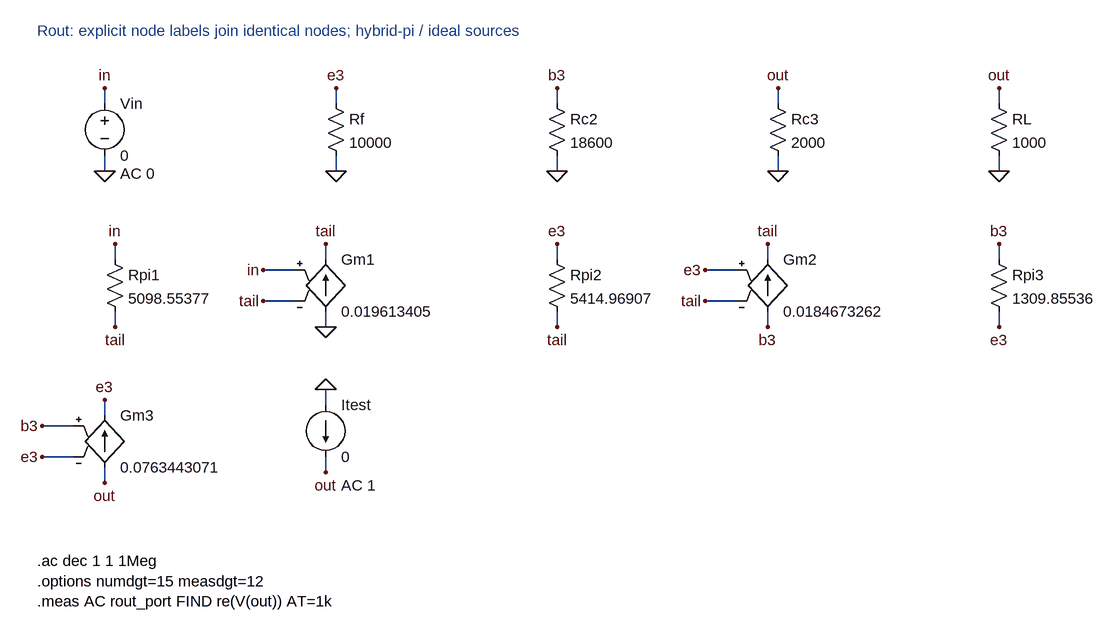
[diagram p0: schematic Rout.asc]
Rout.asc, the LTspice schematic file:
Version 4
SHEET 1 1800 1500
TEXT 16 -48 Left 2 ;Rout: explicit node labels join identical nodes; hybrid-pi / ideal sources
WIRE 120 64 120 40
FLAG 120 40 in
WIRE 120 144 120 168
FLAG 120 168 0
SYMBOL voltage 120 48 R0
SYMATTR InstName Vin
WINDOW 123 24 124 Left 2
SYMATTR Value 0
SYMATTR Value2 AC 0
WIRE 476 64 476 40
FLAG 476 40 e3
WIRE 476 144 476 168
FLAG 476 168 0
SYMBOL res 460 48 R0
SYMATTR InstName Rf
SYMATTR Value 10000
WIRE 816 64 816 40
FLAG 816 40 b3
WIRE 816 144 816 168
FLAG 816 168 0
SYMBOL res 800 48 R0
SYMATTR InstName Rc2
SYMATTR Value 18600
WIRE 1156 64 1156 40
FLAG 1156 40 out
WIRE 1156 144 1156 168
FLAG 1156 168 0
SYMBOL res 1140 48 R0
SYMATTR InstName Rc3
SYMATTR Value 2000
WIRE 1496 64 1496 40
FLAG 1496 40 out
WIRE 1496 144 1496 168
FLAG 1496 168 0
SYMBOL res 1480 48 R0
SYMATTR InstName RL
SYMATTR Value 1000
WIRE 136 304 136 280
FLAG 136 280 in
WIRE 136 384 136 408
FLAG 136 408 tail
SYMBOL res 120 288 R0
SYMATTR InstName Rpi1
SYMATTR Value 5098.55377
WIRE 460 384 460 408
FLAG 460 408 0
WIRE 460 304 460 280
FLAG 460 280 tail
WIRE 412 320 364 320
FLAG 364 320 in
WIRE 412 368 364 368
FLAG 364 368 tail
SYMBOL g 460 288 R0
SYMATTR InstName Gm1
SYMATTR Value 0.019613405
WIRE 816 304 816 280
FLAG 816 280 e3
WIRE 816 384 816 408
FLAG 816 408 tail
SYMBOL res 800 288 R0
SYMATTR InstName Rpi2
SYMATTR Value 5414.96907
WIRE 1140 384 1140 408
FLAG 1140 408 b3
WIRE 1140 304 1140 280
FLAG 1140 280 tail
WIRE 1092 320 1044 320
FLAG 1044 320 e3
WIRE 1092 368 1044 368
FLAG 1044 368 tail
SYMBOL g 1140 288 R0
SYMATTR InstName Gm2
SYMATTR Value 0.0184673262
WIRE 1496 304 1496 280
FLAG 1496 280 b3
WIRE 1496 384 1496 408
FLAG 1496 408 e3
SYMBOL res 1480 288 R0
SYMATTR InstName Rpi3
SYMATTR Value 1309.85536
WIRE 120 624 120 648
FLAG 120 648 out
WIRE 120 544 120 520
FLAG 120 520 e3
WIRE 72 560 24 560
FLAG 24 560 b3
WIRE 72 608 24 608
FLAG 24 608 e3
SYMBOL g 120 528 R0
SYMATTR InstName Gm3
SYMATTR Value 0.0763443071
WIRE 460 528 460 504
FLAG 460 504 0
WIRE 460 608 460 632
FLAG 460 632 out
SYMBOL current 460 528 R0
SYMATTR InstName Itest
WINDOW 123 24 124 Left 2
SYMATTR Value 0
SYMATTR Value2 AC 1
TEXT 16 768 Left 2 !.ac dec 1 1 1Meg\n.options numdgt=15 measdgt=12\n.meas AC rout_port FIND re(V(out)) AT=1k

The netlist it stands for:
* Rout.asc
Vin in 0 0 AC 0
Rf e3 0 10000
Rc2 b3 0 18600
Rc3 out 0 2000
RL out 0 1000
Rpi1 in tail 5098.55377
Gm1 0 tail in tail 0.019613405
Rpi2 e3 tail 5414.96907
Gm2 b3 tail e3 tail 0.0184673262
Rpi3 b3 e3 1309.85536
Gm3 out e3 b3 e3 0.0763443071
Itest 0 out 0 AC 1
* Rout: explicit node labels join identical nodes; hybrid-pi / ideal sources
.ac dec 1 1 1Meg
.options numdgt=15 measdgt=12
.meas AC rout_port FIND re(V(out)) AT=1k
.backanno
.end

* Results of the author's LTspice run, read from the files saved beside the schematic
* From the log:
*   rout_port: re(V(out))=(56.4781748189dB,0°) at 1000